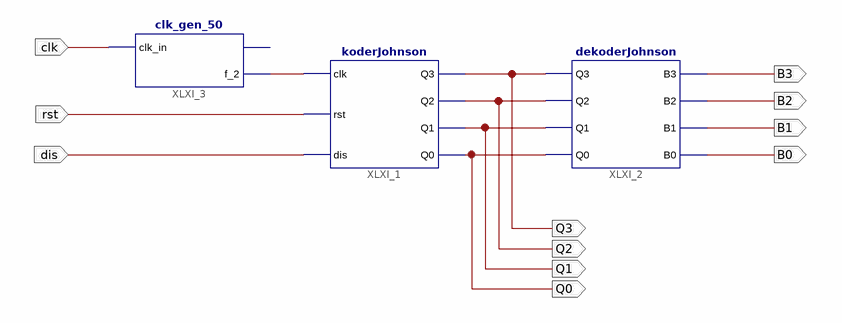
[diagram p0: schematic sheet 1]
// Xilinx ISE schematic symulacja_Johnson.sch (spartan3e) as structural Verilog: 3 symbols, 11 ports
module symulacja_Johnson (
  input  clk,
  input  rst,
  input  dis,
  output Q3,
  output Q2,
  output Q1,
  output Q0,
  output B3,
  output B2,
  output B1,
  output B0
);

  wire XLXN_13;

  koderJohnson XLXI_1 (.clk(XLXN_13), .rst(rst), .Q3(Q3), .Q2(Q2), .Q1(Q1), .Q0(Q0), .dis(dis));
  dekoderJohnson XLXI_2 (.Q2(Q2), .Q0(Q0), .Q3(Q3), .Q1(Q1), .B0(B0), .B3(B3), .B2(B2), .B1(B1));
  clk_gen_50 XLXI_3 (.clk_in(clk), .f_2(XLXN_13));  // open: f_1

  // Notes on the sheet:
  //   LOC on signal Q3 = M15
  //   LOC on signal Q2 = L17
  //   LOC on signal Q1 = K12
  //   LOC on signal Q0 = L15
  //   LOC on signal clk = B8
  //   LOC on signal rst = N17
  //   LOC on signal dis = R17
  //   LOC on signal B3 = M16
  //   LOC on signal B2 = M14
  //   LOC on signal B1 = L16
  //   LOC on signal B0 = K13
endmodule
